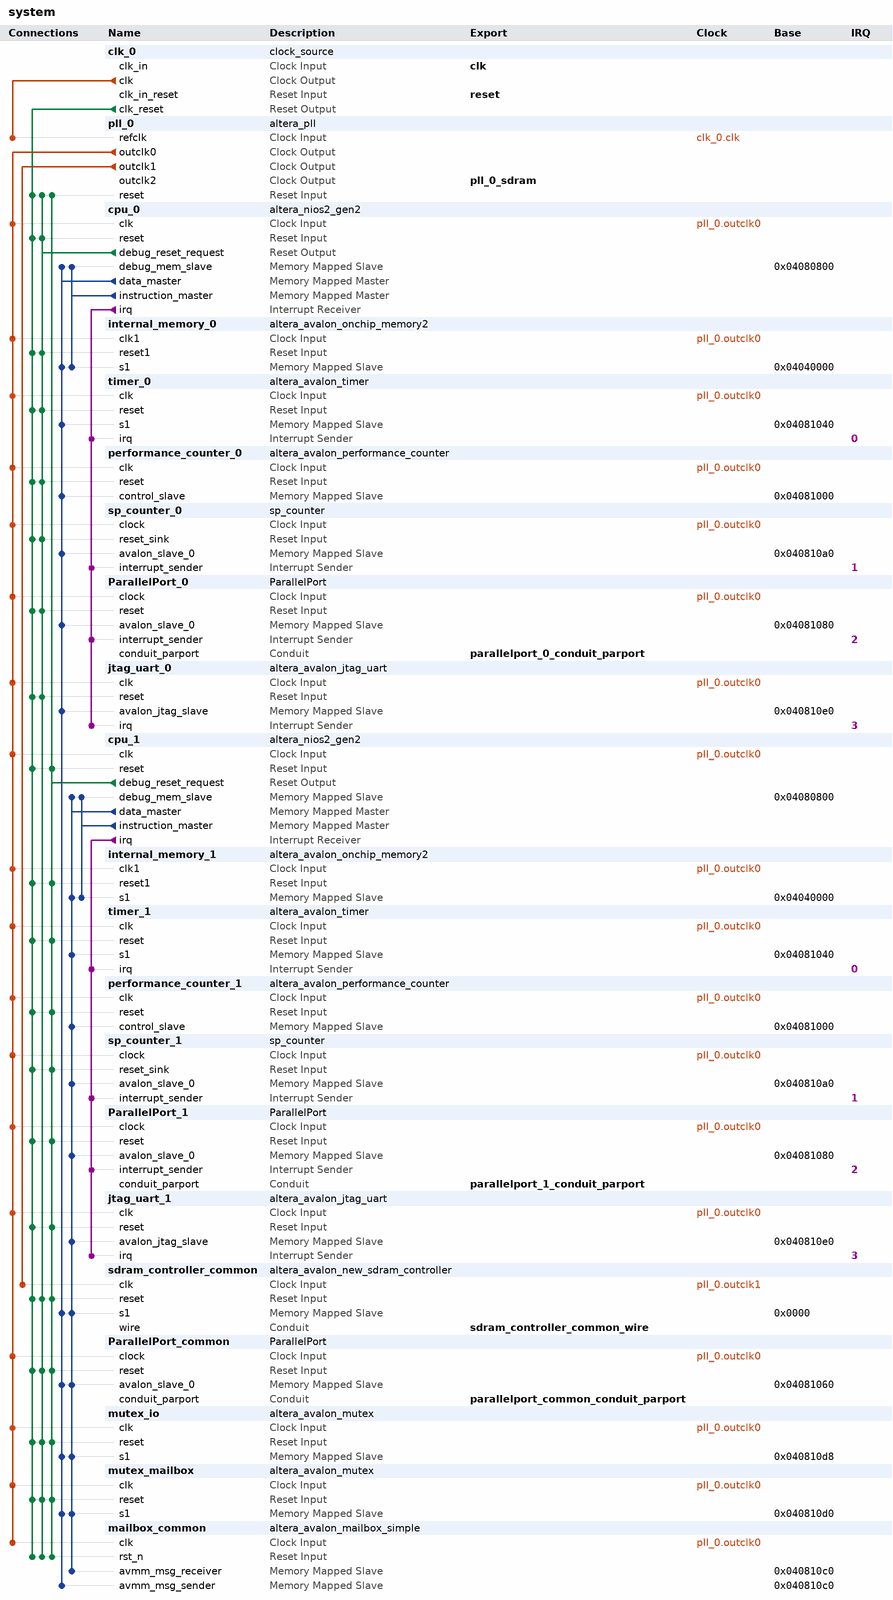
[diagram p0: system contents]
# Platform Designer (Qsys) system system, Cyclone V 5CSEMA5F31C6
# Parameters at their usual value, and those the tool derives, are not listed.
package require -exact qsys 18.1
create_system system
set_project_property DEVICE_FAMILY {Cyclone V}
set_project_property DEVICE 5CSEMA5F31C6

add_instance clk_0 clock_source 18.1
set_instance_parameter_value clk_0 clockFrequency 50000000

add_instance pll_0 altera_pll 18.1
set_instance_parameter_value pll_0 gui_device_speed_grade 1
set_instance_parameter_value pll_0 gui_number_of_clocks 3
set_instance_parameter_value pll_0 gui_operation_mode normal
set_instance_parameter_value pll_0 gui_output_clock_frequency0 50.0
set_instance_parameter_value pll_0 gui_output_clock_frequency1 100.0
set_instance_parameter_value pll_0 gui_output_clock_frequency2 100.0
set_instance_parameter_value pll_0 gui_phase_shift2 -3758
set_instance_parameter_value pll_0 gui_pll_mode {Integer-N PLL}
set_instance_parameter_value pll_0 gui_reference_clock_frequency 50.0
set_instance_parameter_value pll_0 gui_use_locked false

add_instance cpu_0 altera_nios2_gen2 18.1
set_instance_parameter_value cpu_0 dcache_size 2048
set_instance_parameter_value cpu_0 exceptionSlave internal_memory_0.s1
set_instance_parameter_value cpu_0 icache_size 4096
set_instance_parameter_value cpu_0 impl Fast
set_instance_parameter_value cpu_0 resetSlave internal_memory_0.s1

add_instance internal_memory_0 altera_avalon_onchip_memory2 18.1
set_instance_parameter_value internal_memory_0 dataWidth 32
set_instance_parameter_value internal_memory_0 dualPort false
set_instance_parameter_value internal_memory_0 initMemContent true
set_instance_parameter_value internal_memory_0 initializationFileName onchip_mem.hex
set_instance_parameter_value internal_memory_0 memorySize 179200

add_instance timer_0 altera_avalon_timer 18.1
set_instance_parameter_value timer_0 period 100
set_instance_parameter_value timer_0 periodUnits USEC

add_instance performance_counter_0 altera_avalon_performance_counter 18.1
set_instance_parameter_value performance_counter_0 numberOfSections 3

add_instance sp_counter_0 sp_counter 1.0

add_instance ParallelPort_0 ParallelPort 1.0
set_instance_parameter_value ParallelPort_0 width 8

add_instance jtag_uart_0 altera_avalon_jtag_uart 18.1
set_instance_parameter_value jtag_uart_0 simInteractiveOptions NO_INTERACTIVE_WINDOWS

add_instance cpu_1 altera_nios2_gen2 18.1
set_instance_parameter_value cpu_1 cpuID 1
set_instance_parameter_value cpu_1 dcache_size 2048
set_instance_parameter_value cpu_1 exceptionSlave internal_memory_1.s1
set_instance_parameter_value cpu_1 icache_size 4096
set_instance_parameter_value cpu_1 impl Fast
set_instance_parameter_value cpu_1 resetSlave internal_memory_1.s1

add_instance internal_memory_1 altera_avalon_onchip_memory2 18.1
set_instance_parameter_value internal_memory_1 dataWidth 32
set_instance_parameter_value internal_memory_1 dualPort false
set_instance_parameter_value internal_memory_1 initMemContent true
set_instance_parameter_value internal_memory_1 initializationFileName onchip_mem.hex
set_instance_parameter_value internal_memory_1 memorySize 179200

add_instance timer_1 altera_avalon_timer 18.1
set_instance_parameter_value timer_1 period 100
set_instance_parameter_value timer_1 periodUnits USEC

add_instance performance_counter_1 altera_avalon_performance_counter 18.1
set_instance_parameter_value performance_counter_1 numberOfSections 3

add_instance sp_counter_1 sp_counter 1.0

add_instance ParallelPort_1 ParallelPort 1.0
set_instance_parameter_value ParallelPort_1 width 8

add_instance jtag_uart_1 altera_avalon_jtag_uart 18.1
set_instance_parameter_value jtag_uart_1 simInteractiveOptions NO_INTERACTIVE_WINDOWS

add_instance sdram_controller_common altera_avalon_new_sdram_controller 18.1
set_instance_parameter_value sdram_controller_common TAC 5.4
set_instance_parameter_value sdram_controller_common TRCD 15.0
set_instance_parameter_value sdram_controller_common TRP 15.0
set_instance_parameter_value sdram_controller_common casLatency 3
set_instance_parameter_value sdram_controller_common columnWidth 10
set_instance_parameter_value sdram_controller_common dataWidth 16
set_instance_parameter_value sdram_controller_common generateSimulationModel false
set_instance_parameter_value sdram_controller_common model single_Micron_MT48LC4M32B2_7_chip
set_instance_parameter_value sdram_controller_common numberOfBanks 4
set_instance_parameter_value sdram_controller_common numberOfChipSelects 1
set_instance_parameter_value sdram_controller_common powerUpDelay 100.0
set_instance_parameter_value sdram_controller_common refreshPeriod 7.8125
set_instance_parameter_value sdram_controller_common rowWidth 13

add_instance ParallelPort_common ParallelPort 1.0
set_instance_parameter_value ParallelPort_common width 8

add_instance mutex_io altera_avalon_mutex 18.1

add_instance mutex_mailbox altera_avalon_mutex 18.1

add_instance mailbox_common altera_avalon_mailbox_simple 18.1
set_instance_parameter_value mailbox_common AWIDTH 2
set_instance_parameter_value mailbox_common DWIDTH 32
set_instance_parameter_value mailbox_common MSG_ARRIVAL_NOTIFY 1
set_instance_parameter_value mailbox_common MSG_SPACE_NOTIFY 0

# connections
add_connection clk_0.clk pll_0.refclk clock
add_connection pll_0.outclk0 cpu_0.clk clock
add_connection pll_0.outclk0 cpu_1.clk clock
add_connection pll_0.outclk0 internal_memory_0.clk1 clock
add_connection pll_0.outclk0 internal_memory_1.clk1 clock
add_connection pll_0.outclk0 jtag_uart_0.clk clock
add_connection pll_0.outclk0 jtag_uart_1.clk clock
add_connection pll_0.outclk0 mailbox_common.clk clock
add_connection pll_0.outclk0 mutex_io.clk clock
add_connection pll_0.outclk0 mutex_mailbox.clk clock
add_connection pll_0.outclk0 ParallelPort_0.clock clock
add_connection pll_0.outclk0 ParallelPort_1.clock clock
add_connection pll_0.outclk0 ParallelPort_common.clock clock
add_connection pll_0.outclk0 performance_counter_0.clk clock
add_connection pll_0.outclk0 performance_counter_1.clk clock
add_connection pll_0.outclk0 sp_counter_0.clock clock
add_connection pll_0.outclk0 sp_counter_1.clock clock
add_connection pll_0.outclk0 timer_0.clk clock
add_connection pll_0.outclk0 timer_1.clk clock
add_connection pll_0.outclk1 sdram_controller_common.clk clock
add_connection clk_0.clk_reset cpu_0.reset reset
add_connection clk_0.clk_reset cpu_1.reset reset
add_connection clk_0.clk_reset internal_memory_0.reset1 reset
add_connection clk_0.clk_reset internal_memory_1.reset1 reset
add_connection clk_0.clk_reset jtag_uart_0.reset reset
add_connection clk_0.clk_reset jtag_uart_1.reset reset
add_connection clk_0.clk_reset mailbox_common.rst_n reset
add_connection clk_0.clk_reset mutex_io.reset reset
add_connection clk_0.clk_reset mutex_mailbox.reset reset
add_connection clk_0.clk_reset ParallelPort_0.reset reset
add_connection clk_0.clk_reset ParallelPort_1.reset reset
add_connection clk_0.clk_reset ParallelPort_common.reset reset
add_connection clk_0.clk_reset performance_counter_0.reset reset
add_connection clk_0.clk_reset performance_counter_1.reset reset
add_connection clk_0.clk_reset pll_0.reset reset
add_connection clk_0.clk_reset sdram_controller_common.reset reset
add_connection clk_0.clk_reset sp_counter_0.reset_sink reset
add_connection clk_0.clk_reset sp_counter_1.reset_sink reset
add_connection clk_0.clk_reset timer_0.reset reset
add_connection clk_0.clk_reset timer_1.reset reset
add_connection cpu_0.debug_reset_request cpu_0.reset reset
add_connection cpu_0.debug_reset_request internal_memory_0.reset1 reset
add_connection cpu_0.debug_reset_request jtag_uart_0.reset reset
add_connection cpu_0.debug_reset_request mailbox_common.rst_n reset
add_connection cpu_0.debug_reset_request mutex_io.reset reset
add_connection cpu_0.debug_reset_request mutex_mailbox.reset reset
add_connection cpu_0.debug_reset_request ParallelPort_0.reset reset
add_connection cpu_0.debug_reset_request ParallelPort_common.reset reset
add_connection cpu_0.debug_reset_request performance_counter_0.reset reset
add_connection cpu_0.debug_reset_request pll_0.reset reset
add_connection cpu_0.debug_reset_request sdram_controller_common.reset reset
add_connection cpu_0.debug_reset_request sp_counter_0.reset_sink reset
add_connection cpu_0.debug_reset_request timer_0.reset reset
add_connection cpu_1.debug_reset_request cpu_1.reset reset
add_connection cpu_1.debug_reset_request internal_memory_1.reset1 reset
add_connection cpu_1.debug_reset_request jtag_uart_1.reset reset
add_connection cpu_1.debug_reset_request mailbox_common.rst_n reset
add_connection cpu_1.debug_reset_request mutex_io.reset reset
add_connection cpu_1.debug_reset_request mutex_mailbox.reset reset
add_connection cpu_1.debug_reset_request ParallelPort_1.reset reset
add_connection cpu_1.debug_reset_request ParallelPort_common.reset reset
add_connection cpu_1.debug_reset_request performance_counter_1.reset reset
add_connection cpu_1.debug_reset_request pll_0.reset reset
add_connection cpu_1.debug_reset_request sdram_controller_common.reset reset
add_connection cpu_1.debug_reset_request sp_counter_1.reset_sink reset
add_connection cpu_1.debug_reset_request timer_1.reset reset
add_connection cpu_0.data_master cpu_0.debug_mem_slave avalon
set_connection_parameter_value cpu_0.data_master/cpu_0.debug_mem_slave baseAddress 0x04080800
add_connection cpu_0.data_master internal_memory_0.s1 avalon
set_connection_parameter_value cpu_0.data_master/internal_memory_0.s1 baseAddress 0x04040000
add_connection cpu_0.data_master jtag_uart_0.avalon_jtag_slave avalon
set_connection_parameter_value cpu_0.data_master/jtag_uart_0.avalon_jtag_slave baseAddress 0x040810e0
add_connection cpu_0.data_master mailbox_common.avmm_msg_sender avalon
set_connection_parameter_value cpu_0.data_master/mailbox_common.avmm_msg_sender baseAddress 0x040810c0
add_connection cpu_0.data_master mutex_io.s1 avalon
set_connection_parameter_value cpu_0.data_master/mutex_io.s1 baseAddress 0x040810d8
add_connection cpu_0.data_master mutex_mailbox.s1 avalon
set_connection_parameter_value cpu_0.data_master/mutex_mailbox.s1 baseAddress 0x040810d0
add_connection cpu_0.data_master ParallelPort_0.avalon_slave_0 avalon
set_connection_parameter_value cpu_0.data_master/ParallelPort_0.avalon_slave_0 baseAddress 0x04081080
add_connection cpu_0.data_master ParallelPort_common.avalon_slave_0 avalon
set_connection_parameter_value cpu_0.data_master/ParallelPort_common.avalon_slave_0 baseAddress 0x04081060
add_connection cpu_0.data_master performance_counter_0.control_slave avalon
set_connection_parameter_value cpu_0.data_master/performance_counter_0.control_slave baseAddress 0x04081000
add_connection cpu_0.data_master sdram_controller_common.s1 avalon
set_connection_parameter_value cpu_0.data_master/sdram_controller_common.s1 baseAddress 0x0000
add_connection cpu_0.data_master sp_counter_0.avalon_slave_0 avalon
set_connection_parameter_value cpu_0.data_master/sp_counter_0.avalon_slave_0 baseAddress 0x040810a0
add_connection cpu_0.data_master timer_0.s1 avalon
set_connection_parameter_value cpu_0.data_master/timer_0.s1 baseAddress 0x04081040
add_connection cpu_0.instruction_master cpu_0.debug_mem_slave avalon
set_connection_parameter_value cpu_0.instruction_master/cpu_0.debug_mem_slave baseAddress 0x04080800
add_connection cpu_0.instruction_master internal_memory_0.s1 avalon
set_connection_parameter_value cpu_0.instruction_master/internal_memory_0.s1 baseAddress 0x04040000
add_connection cpu_1.data_master cpu_1.debug_mem_slave avalon
set_connection_parameter_value cpu_1.data_master/cpu_1.debug_mem_slave baseAddress 0x04080800
add_connection cpu_1.data_master internal_memory_1.s1 avalon
set_connection_parameter_value cpu_1.data_master/internal_memory_1.s1 baseAddress 0x04040000
add_connection cpu_1.data_master jtag_uart_1.avalon_jtag_slave avalon
set_connection_parameter_value cpu_1.data_master/jtag_uart_1.avalon_jtag_slave baseAddress 0x040810e0
add_connection cpu_1.data_master mailbox_common.avmm_msg_receiver avalon
set_connection_parameter_value cpu_1.data_master/mailbox_common.avmm_msg_receiver baseAddress 0x040810c0
add_connection cpu_1.data_master mutex_io.s1 avalon
set_connection_parameter_value cpu_1.data_master/mutex_io.s1 baseAddress 0x040810d8
add_connection cpu_1.data_master mutex_mailbox.s1 avalon
set_connection_parameter_value cpu_1.data_master/mutex_mailbox.s1 baseAddress 0x040810d0
add_connection cpu_1.data_master ParallelPort_1.avalon_slave_0 avalon
set_connection_parameter_value cpu_1.data_master/ParallelPort_1.avalon_slave_0 baseAddress 0x04081080
add_connection cpu_1.data_master ParallelPort_common.avalon_slave_0 avalon
set_connection_parameter_value cpu_1.data_master/ParallelPort_common.avalon_slave_0 baseAddress 0x04081060
add_connection cpu_1.data_master performance_counter_1.control_slave avalon
set_connection_parameter_value cpu_1.data_master/performance_counter_1.control_slave baseAddress 0x04081000
add_connection cpu_1.data_master sdram_controller_common.s1 avalon
set_connection_parameter_value cpu_1.data_master/sdram_controller_common.s1 baseAddress 0x0000
add_connection cpu_1.data_master sp_counter_1.avalon_slave_0 avalon
set_connection_parameter_value cpu_1.data_master/sp_counter_1.avalon_slave_0 baseAddress 0x040810a0
add_connection cpu_1.data_master timer_1.s1 avalon
set_connection_parameter_value cpu_1.data_master/timer_1.s1 baseAddress 0x04081040
add_connection cpu_1.instruction_master cpu_1.debug_mem_slave avalon
set_connection_parameter_value cpu_1.instruction_master/cpu_1.debug_mem_slave baseAddress 0x04080800
add_connection cpu_1.instruction_master internal_memory_1.s1 avalon
set_connection_parameter_value cpu_1.instruction_master/internal_memory_1.s1 baseAddress 0x04040000
add_connection cpu_0.irq jtag_uart_0.irq interrupt
set_connection_parameter_value cpu_0.irq/jtag_uart_0.irq irqNumber 3
add_connection cpu_0.irq ParallelPort_0.interrupt_sender interrupt
set_connection_parameter_value cpu_0.irq/ParallelPort_0.interrupt_sender irqNumber 2
add_connection cpu_0.irq sp_counter_0.interrupt_sender interrupt
set_connection_parameter_value cpu_0.irq/sp_counter_0.interrupt_sender irqNumber 1
add_connection cpu_0.irq timer_0.irq interrupt
set_connection_parameter_value cpu_0.irq/timer_0.irq irqNumber 0
add_connection cpu_1.irq jtag_uart_1.irq interrupt
set_connection_parameter_value cpu_1.irq/jtag_uart_1.irq irqNumber 3
add_connection cpu_1.irq ParallelPort_1.interrupt_sender interrupt
set_connection_parameter_value cpu_1.irq/ParallelPort_1.interrupt_sender irqNumber 2
add_connection cpu_1.irq sp_counter_1.interrupt_sender interrupt
set_connection_parameter_value cpu_1.irq/sp_counter_1.interrupt_sender irqNumber 1
add_connection cpu_1.irq timer_1.irq interrupt
set_connection_parameter_value cpu_1.irq/timer_1.irq irqNumber 0

# exported interfaces
add_interface clk clock sink
set_interface_property clk EXPORT_OF clk_0.clk_in
add_interface parallelport_0_conduit_parport conduit end
set_interface_property parallelport_0_conduit_parport EXPORT_OF ParallelPort_0.conduit_parport
add_interface parallelport_1_conduit_parport conduit end
set_interface_property parallelport_1_conduit_parport EXPORT_OF ParallelPort_1.conduit_parport
add_interface parallelport_common_conduit_parport conduit end
set_interface_property parallelport_common_conduit_parport EXPORT_OF ParallelPort_common.conduit_parport
add_interface pll_0_sdram clock source
set_interface_property pll_0_sdram EXPORT_OF pll_0.outclk2
add_interface reset reset sink
set_interface_property reset EXPORT_OF clk_0.clk_in_reset
add_interface sdram_controller_common_wire conduit end
set_interface_property sdram_controller_common_wire EXPORT_OF sdram_controller_common.wire

set_interconnect_requirement {$system} qsys_mm.clockCrossingAdapter HANDSHAKE
set_interconnect_requirement {$system} qsys_mm.enableEccProtection FALSE
set_interconnect_requirement {$system} qsys_mm.insertDefaultSlave FALSE
set_interconnect_requirement {$system} qsys_mm.maxAdditionalLatency 1

save_system system.qsys
